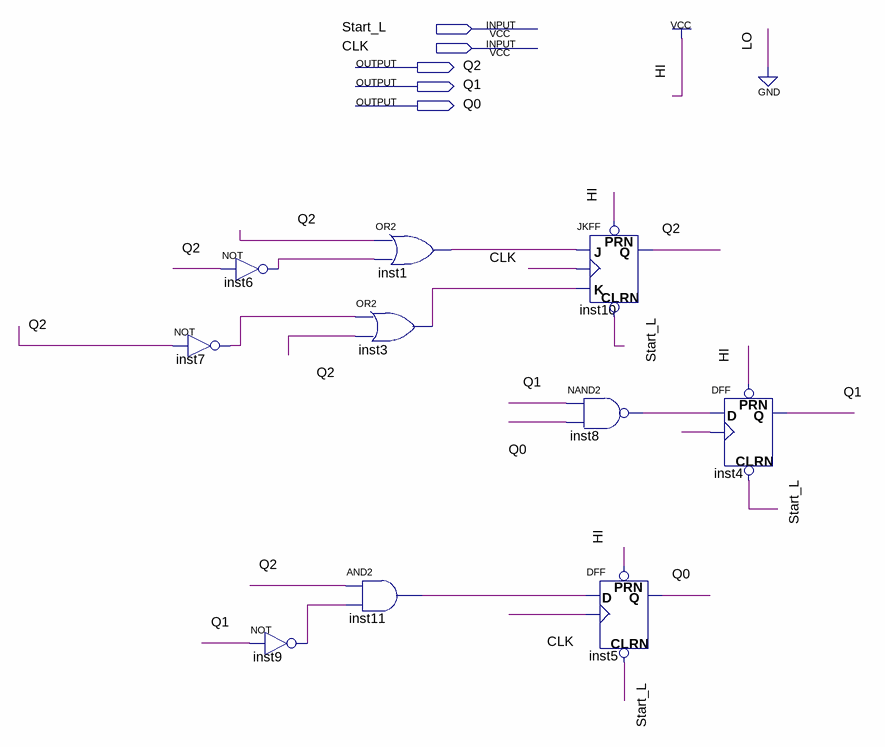
[diagram p0: schematic sheet]
// Quartus schematic Quiz3.bdf as structural Verilog: 10 symbols, 5 pins
module Quiz3 (
  input  Start_L,
  input  CLK,
  output Q2,
  output Q1,
  output Q0
);

  wire inst1_out, inst3_out, inst6_out, inst7_out, inst8_out, inst9_out, inst11_out, undriven;

  not inst6 (inst6_out, Q2);
  not inst7 (inst7_out, Q2);
  not inst9 (inst9_out, Q1);
  or inst1 (inst1_out, Q2, inst6_out);
  or inst3 (inst3_out, inst7_out, Q2);
  and inst11 (inst11_out, Q2, inst9_out);
  JKFF inst10 (.PRN(1'b1), .CLRN(Start_L), .K(inst3_out), .J(inst1_out), .CLK(CLK), .Q(Q2));
  nand inst8 (inst8_out, Q1, Q0);
  DFF inst5 (.CLRN(Start_L), .CLK(CLK), .D(inst11_out), .PRN(1'b1), .Q(Q0));
  DFF inst4 (.CLRN(Start_L), .CLK(undriven), .D(inst8_out), .PRN(1'b1), .Q(Q1));
endmodule
